# Altium schematic sheet FPGA_Tester_Board_Cover.SchDoc
size B; Organization: Altium Limited; Address1: L3, 12a Rodborough Rd; Address2: Frenchs Forest; Address3: NSW; Address4: Australia 2086; SheetNumber: 1; SheetTotal: 1
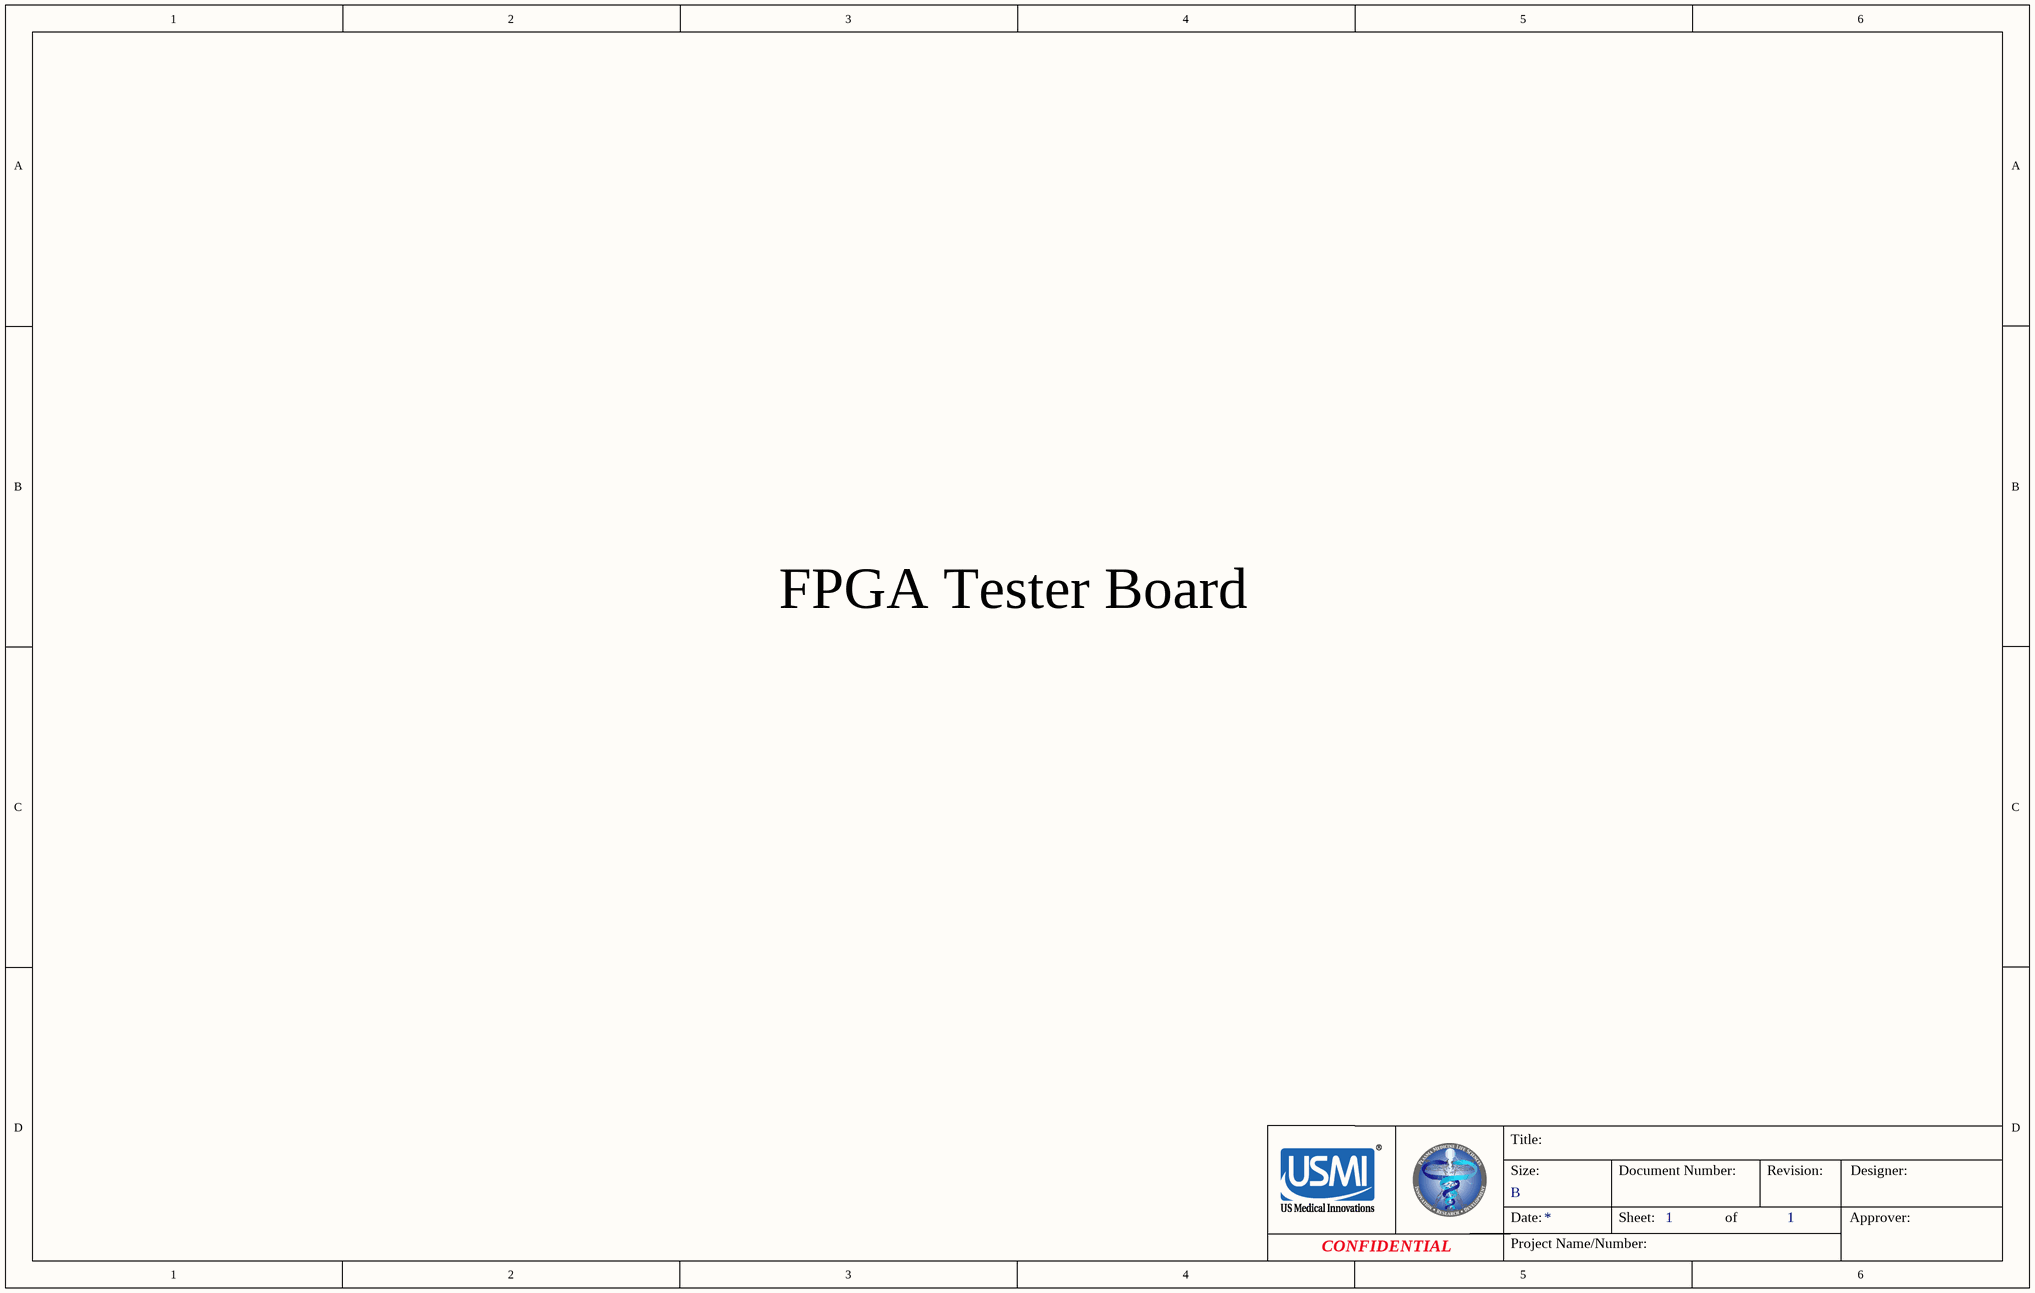
[diagram p0: FPGA_Tester_Board_Cover.SchDoc]

## Notes on the sheet
- FPGA Tester Board
- Title:
- Size:
- Document Number:
- Revision:
- Designer:
- Date:
- Project Name/Number:
- B
- Sheet:
- of
- Approver:
- CONFIDENTIAL